# Altium schematic sheet Connectors.SchDoc
size A
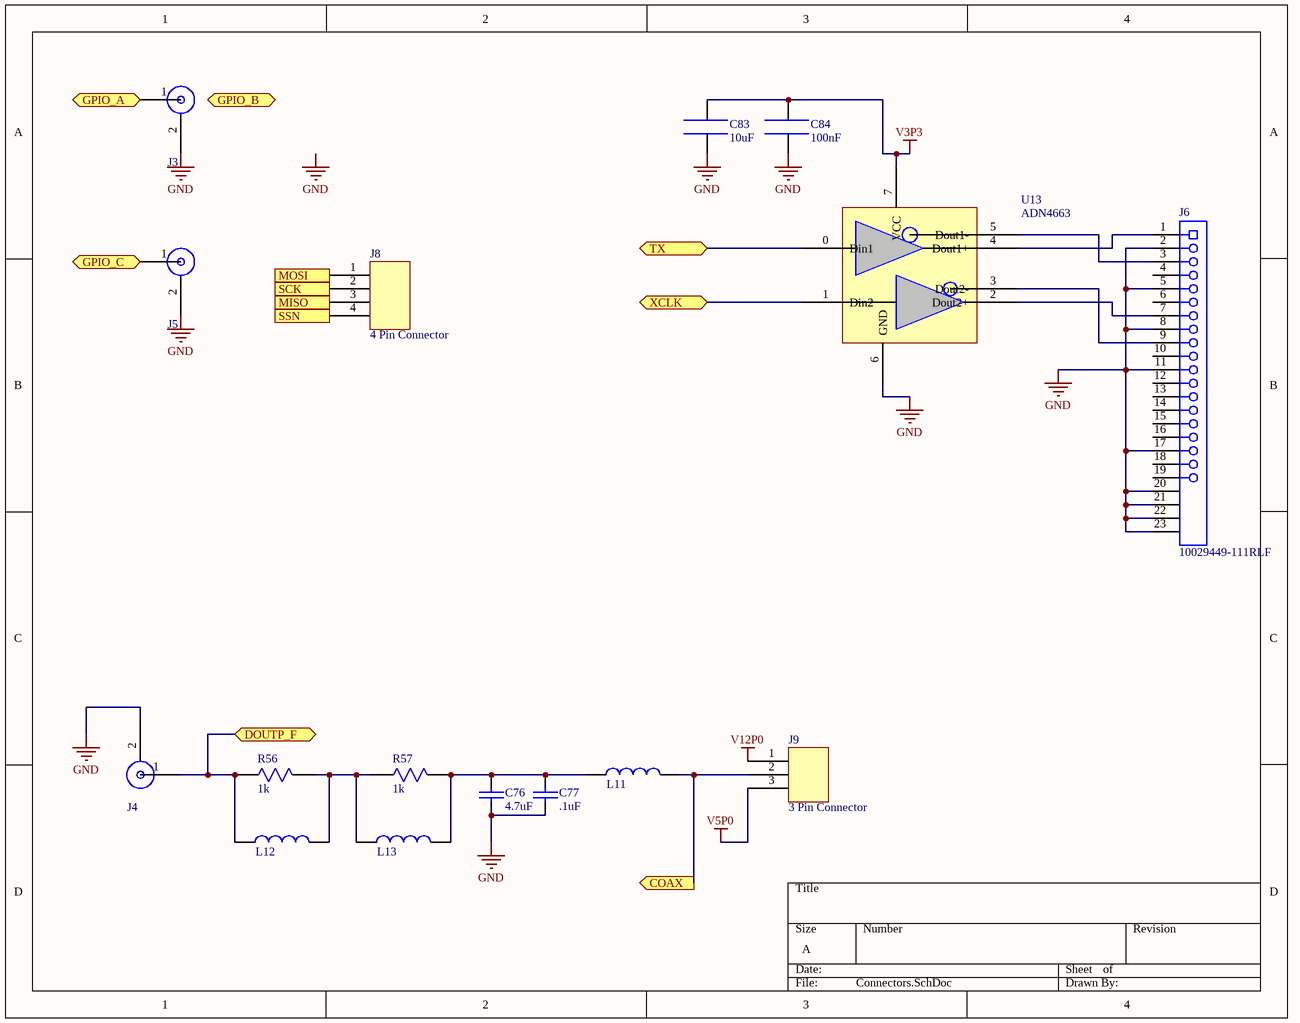
[diagram p0: Connectors.SchDoc]

## Parts
C76  4.7uF  [SMD Capacitor 0603]
C77  .1uF  [SMD CAP 0402]
C83  value 10uF  [SMD Capacitor 0603]  (hidden comment: Capacitor)
C84  value 100nF  [SMD Capacitor 0603]  (hidden comment: Capacitor)
J3  SMA  [SMA Right Angle Through Hole]  (value not drawn)
J4  SMA  [SMA Right Angle Through Hole]  (value not drawn)
J5  SMA  [SMA Right Angle Through Hole]  (value not drawn)
J6  10029449-111RLF  [FCI-10029449-111RLF_V]
J8  4 Pin Connector  [4Pin Verital 0.1"]
J9  3 Pin Connector  [3Pin Verital 0.1" JUMOER]
L11  Ferrite Bead  [BLM18KG601SN1D]  (value not drawn)
L12  Ferrite Bead  [CIG21L4R7MNE]  (value not drawn)
L13  Ferrite Bead  [CBC3225T101MR]  (value not drawn)
R56  1k  [SMD Resistor 0603]
R57  1k  [SMD Resistor 0603]
U13  ADN4663  [SOIC127P600X175-8N]

## Ports
COAX (out), DOUTP_F (bidir), GPIO_A (bidir), GPIO_B (bidir), GPIO_C (bidir), MISO (out), MOSI (in), SCK (in), SSN (in), TX (bidir), XCLK (bidir)

## Nets
GND: C76.1 C77.1 C83.0 C84.0 J3.2 J4.2 J5.2 J6.2 J6.5 J6.8 J6.11 J6.17 J6.20(SHLD1) J6.21(SHLD2) J6.22(SHLD3) J6.23(SHLD4) U13.6(GND)
V3P3: C83.1 C84.1 U13.7(VCC)
V5P0: J9.3
V12P0: J9.1
COAX: J9.2 L11.2 ; port COAX
DOUTP_F: J4.1 L12.1 R56.0 ; port DOUTP_F
GPIO_A: J3.1 ; port GPIO_A
GPIO_C: J5.1 ; port GPIO_C
MISO: J8.3 ; port MISO
MOSI: J8.1 ; port MOSI
SCK: J8.2 ; port SCK
SSN: J8.4 ; port SSN
TX: U13.0(Din1) ; port TX
XCLK: U13.1(Din2) ; port XCLK
NetC76_0: C76.0 C77.0 L11.1 L13.2 R57.1
NetJ6_1: J6.1 U13.4(Dout1+)
NetJ6_3: J6.3 U13.5(Dout1-)
NetJ6_7: J6.7 U13.2(Dout2+)
NetJ6_9: J6.9 U13.3(Dout2-)
NetL12_2: L12.2 L13.1 R56.1 R57.0

Not connected (* = marked no-connect by the designer): J6 4 6 10 12 13 14 15 16 18 19

## Notes on the sheet
- Labels drawn without touching a wire or pin: GND

## Library data of the parts
C76 C77 = Capacitor: Value: C?
J6 = CMP-2000-05117-1: Surface Mount Type A HDMI Receptacle without Flange, 19 Positions, 0.5 mm Pitch, -55 to 85 degC, RoHS, Tape and Reel; Manufacturer: FCI; Gender: Female; Number of Positions / Contacts: 19; Contact Rating: 0.5A; Voltage Rating: 40V; Insulation Resistance: 100MOhms; RoHS: Details; Datasheet URL: https://datasheet.ciiva.com/851/10029449-851120.pdf; Termination Style: SMD; Contact Plating: Gold; Housing Material: Resin; Product Type: HDMI; Color: Black; Number of Positions: 19; Mounting Style: SMD/SMT; Packaging: Reel; Brand: FCI; Manufacturer URL: http://www.fci.com/; Contact Material: CopperAlloy; Orientation: Horizontal; Factory Pack Quantity: 400; Operating Temperature Range: -55Cto+85C; Product Category: HDMI,Displayport&DVIConnectors; Datasheet Version: Rev. S, 06/2012
R56 R57 = Resistor: Value: ?
U13 = DUAL_LVDS_TX: pin to pad: 0>2 1>3 2>6 3>5 4>7 5>8 6>4 7>1